# Altium project shelfControl.PrjPCB
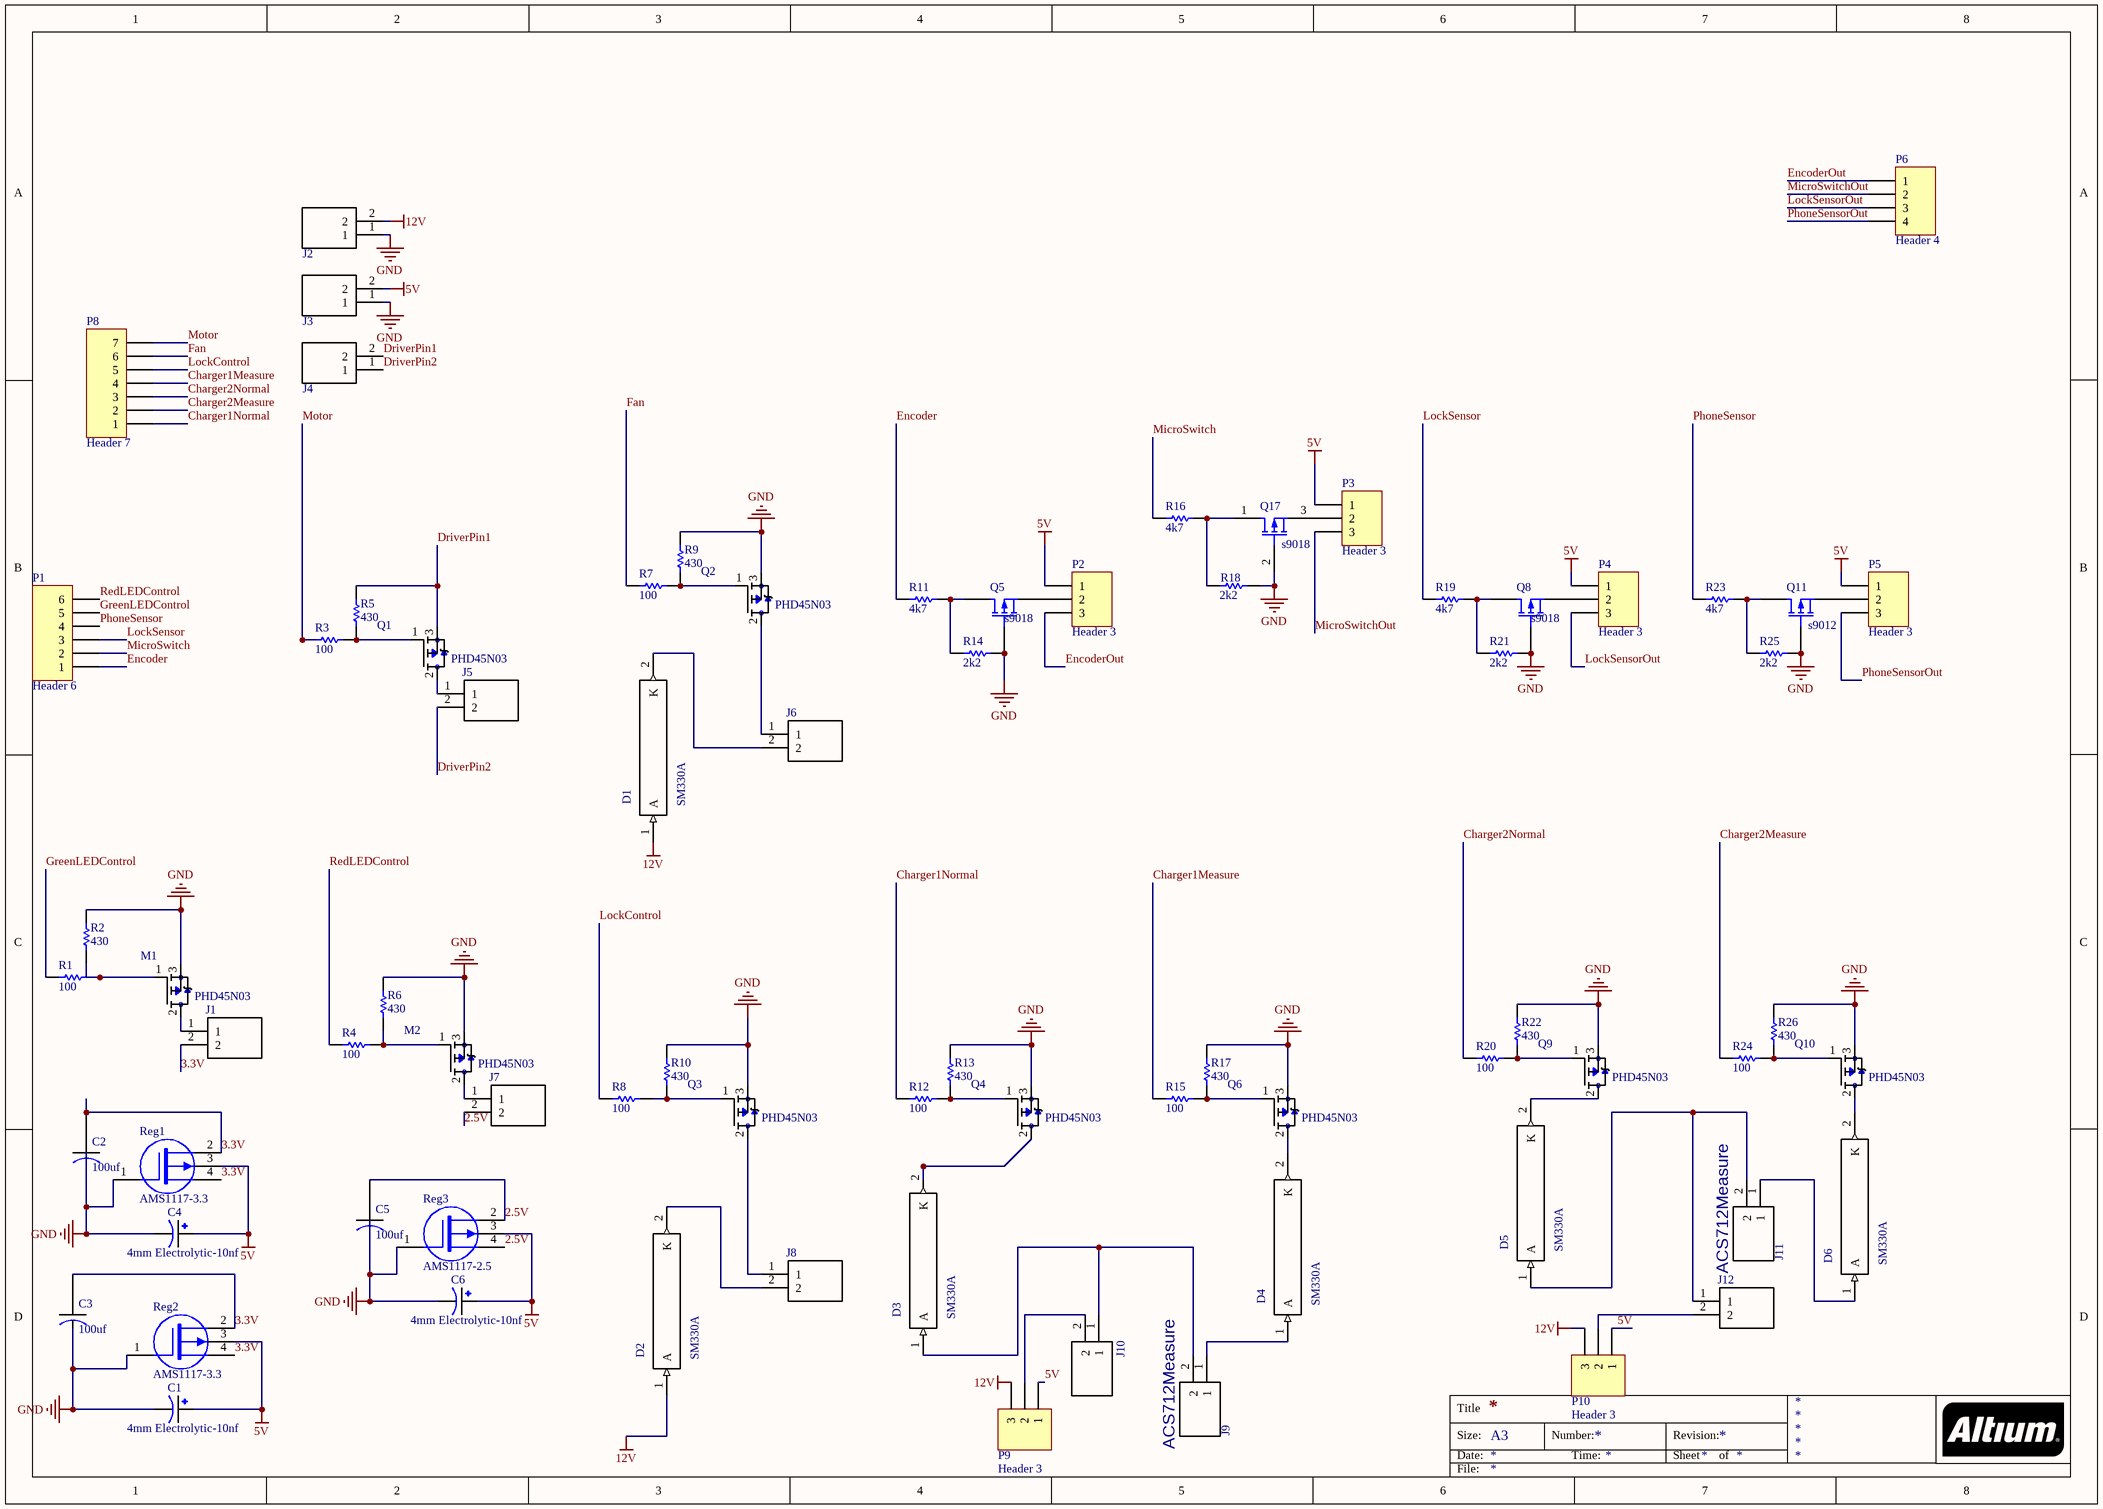
[diagram p0: shelfControl.SchDoc]
1 sheet, 75 parts. Net scope: global (net labels, ports and power ports of the same name join across sheets).
Board files: shelfControl 5V.PcbDoc, shelfControl.PcbDoc, acs712Connect.PcbDoc, order-SecUpdate.PcbDoc

## Sheet shelfControl.SchDoc
size A3

### Parts
C1  4mm Electrolytic-10nf  [*CAP_EEE-FP1C100AR]
C2  100uf  [*CAPAE0607X600N_16SVPC100M(Primary)]
C3  100uf  [*CAPAE0607X600N_16SVPC100M(Primary)]
C4  4mm Electrolytic-10nf  [*CAP_EEE-FP1C100AR]
C5  100uf  [*CAPAE0607X600N_16SVPC100M(Primary)]
C6  4mm Electrolytic-10nf  [*CAP_EEE-FP1C100AR]
D1  SM330A  [*DIOM5227X270N_S1M(Primary)]
D2  SM330A  [*DIOM5227X270N_S1M(Primary)]
D3  SM330A  [*DIOM5227X270N_S1M(Primary)]
D4  SM330A  [*DIOM5227X270N_S1M(Primary)]
D5  SM330A  [*DIOM5227X270N_S1M(Primary)]
D6  SM330A  [*DIOM5227X270N_S1M(Primary)]
J1  6-1123723-2  [*TE_6-1123723-2]  (value not drawn)
J2  6-1123723-2  [*TE_6-1123723-2]  (value not drawn)
J3  6-1123723-2  [*TE_6-1123723-2]  (value not drawn)
J4  6-1123723-2  [*TE_6-1123723-2]  (value not drawn)
J5  6-1123723-2  [*TE_6-1123723-2]  (value not drawn)
J6  6-1123723-2  [*TE_6-1123723-2]  (value not drawn)
J7  6-1123723-2  [*TE_6-1123723-2]  (value not drawn)
J8  6-1123723-2  [*TE_6-1123723-2]  (value not drawn)
J9  ACS712Measure  [*TE_6-1123723-2]
J10  6-1123723-2  [*TE_6-1123723-2]  (value not drawn)
J11  ACS712Measure  [*TE_6-1123723-2]
J12  6-1123723-2  [*TE_6-1123723-2]  (value not drawn)
M1  PHD45N03  [*DPAK228P998X235-3N]
M2  PHD45N03  [*DPAK228P998X235-3N]
P1  Header 6  [HDR1X6]
P2  Header 3  [HDR1X3]
P3  Header 3  [HDR1X3]
P4  Header 3  [HDR1X3]
P5  Header 3  [HDR1X3]
P6  Header 4  [HDR1X4]
P8  Header 7  [HDR1X7]
P9  Header 3  [HDR1X3]
P10  Header 3  [HDR1X3]
Q1  PHD45N03  [*DPAK228P998X235-3N]
Q2  PHD45N03  [*DPAK228P998X235-3N]
Q3  PHD45N03  [*DPAK228P998X235-3N]
Q4  PHD45N03  [*DPAK228P998X235-3N]
Q5  s9018  [SOT-23_N]
Q6  PHD45N03  [*DPAK228P998X235-3N]
Q8  s9018  [SOT-23_N]
Q9  PHD45N03  [*DPAK228P998X235-3N]
Q10  PHD45N03  [*DPAK228P998X235-3N]
Q11  s9012  [SOT-23_N]
Q17  s9018  [SOT-23_N]
R1  value 100  [6-0805_L]  (hidden comment: R100)
R2  value 430  [6-0805_L]  (hidden comment: R430)
R3  value 100  [6-0805_L]  (hidden comment: R100)
R4  value 100  [6-0805_L]  (hidden comment: R100)
R5  value 430  [6-0805_L]  (hidden comment: R430)
R6  value 430  [6-0805_L]  (hidden comment: R430)
R7  value 100  [6-0805_L]  (hidden comment: R100)
R8  value 100  [6-0805_L]  (hidden comment: R100)
R9  value 430  [6-0805_L]  (hidden comment: R430)
R10  value 430  [6-0805_L]  (hidden comment: R430)
R11  value 4k7  [6-0805_L]  (hidden comment: R4k7)
R12  value 100  [6-0805_L]  (hidden comment: R100)
R13  value 430  [6-0805_L]  (hidden comment: R430)
R14  value 2k2  [6-0805_L]  (hidden comment: R2k2)
R15  value 100  [6-0805_L]  (hidden comment: R100)
R16  value 4k7  [6-0805_L]  (hidden comment: R4k7)
R17  value 430  [6-0805_L]  (hidden comment: R430)
R18  value 2k2  [6-0805_L]  (hidden comment: R2k2)
R19  value 4k7  [6-0805_L]  (hidden comment: R4k7)
R20  value 100  [6-0805_L]  (hidden comment: R100)
R21  value 2k2  [6-0805_L]  (hidden comment: R2k2)
R22  value 430  [6-0805_L]  (hidden comment: R430)
R23  value 4k7  [6-0805_L]  (hidden comment: R4k7)
R24  value 100  [6-0805_L]  (hidden comment: R100)
R25  value 2k2  [6-0805_L]  (hidden comment: R2k2)
R26  value 430  [6-0805_L]  (hidden comment: R430)
Reg1  AMS1117-3.3  [SOT223_N]
Reg2  AMS1117-3.3  [SOT223_N]
Reg3  AMS1117-2.5  [SOT223_N]

### Nets
5V: C1.1 C4.1 C6.1 J3.2 P2.1 P3.1 P4.1 P5.1 P9.1 P10.1 Reg1.3(U) Reg2.3(U) Reg3.3(U)
12V: D1.1(A) D2.1(A) J2.2 P9.3 P10.3
GND: C1.2 C2.NEG C3.NEG C4.2 C5.NEG C6.2 J2.1 J3.1 M1.3(S) M2.3(S) Q2.3(S) Q3.3(S) Q4.3(S) Q5.2(G) Q6.3(S) Q8.2(G) Q9.3(S) Q10.3(S) Q11.2(G) Q17.2(G) R2.1 R6.1 R9.1 R10.1 R13.1 R14.2 R17.1 R18.1 R21.2 R22.1 R25.2 R26.1 Reg1.1(G) Reg2.1(G) Reg3.1(G)
2.5V: C5.POS J7.2 Reg3.2(D) Reg3.4(S)
3.3V: C2.POS C3.POS J1.2 Reg1.2(D) Reg1.4(S) Reg2.2(D) Reg2.4(S)
Charger1Measure: P8.4 R15.1
Charger1Normal: P8.1 R12.1
Charger2Measure: P8.2 R24.1
Charger2Normal: P8.3 R20.1
DriverPin1: J4.2 Q1.3(S) R5.1
DriverPin2: J4.1 J5.2
Encoder: P1.1 R11.1
EncoderOut: P2.3 P6.1
Fan: P8.6 R7.1
GreenLEDControl: P1.5 R1.1
LockControl: P8.5 R8.1
LockSensor: P1.3 R19.1
LockSensorOut: P4.3 P6.3
MicroSwitch: P1.2 R16.2
MicroSwitchOut: P3.3 P6.2
Motor: P8.7 R3.1
PhoneSensor: P1.4 R23.1
PhoneSensorOut: P5.3 P6.4
RedLEDControl: P1.6 R4.1
NetD1_2: D1.2(K) J6.2
NetD2_2: D2.2(K) J8.2
NetD3_1: D3.1(A) J9.2 J10.1
NetD3_2: D3.2(K) Q4.2(D)
NetD4_1: D4.1(A) J9.1
NetD4_2: D4.2(K) Q6.2(D)
NetD5_1: D5.1(A) J11.2 J12.1
NetD5_2: D5.2(K) Q9.2(D)
NetD6_1: D6.1(A) J11.1
NetD6_2: D6.2(K) Q10.2(D)
NetJ1_1: J1.1 M1.2(D)
NetJ5_1: J5.1 Q1.2(D)
NetJ6_1: J6.1 Q2.2(D)
NetJ7_1: J7.1 M2.2(D)
NetJ8_1: J8.1 Q3.2(D)
NetJ10_2: J10.2 P9.2
NetJ12_2: J12.2 P10.2
NetM1_1: M1.1(G) R1.2 R2.2
NetM2_1: M2.1(G) R4.2 R6.2
NetP2_2: P2.2 Q5.3(S)
NetP3_2: P3.2 Q17.3(S)
NetP4_2: P4.2 Q8.3(S)
NetP5_2: P5.2 Q11.3(S)
NetQ1_1: Q1.1(G) R3.2 R5.2
NetQ2_1: Q2.1(G) R7.2 R9.2
NetQ3_1: Q3.1(G) R8.2 R10.2
NetQ4_1: Q4.1(G) R12.2 R13.2
NetQ5_1: Q5.1(D) R11.2 R14.1
NetQ6_1: Q6.1(G) R15.2 R17.2
NetQ8_1: Q8.1(D) R19.2 R21.1
NetQ9_1: Q9.1(G) R20.2 R22.2
NetQ10_1: Q10.1(G) R24.2 R26.2
NetQ11_1: Q11.1(D) R23.2 R25.1
NetQ17_1: Q17.1(D) R16.1 R18.2

### Notes on the sheet
- Title
- Size:
- Date:
- A3
- Number:
- Time:
- Revision:
- Sheet
- of
- File:

### Library data of the parts
C1 C4 C6 = EEE-FP1C100AR: Electrolytic capacitor SMD 10 آµF 16 V 20 % _أک x L_ 4 mm x 5.8 mm Panasonic EEEFP1C100AR 1 pc_s_; MF: Panasonic Electronic; MP: EEEFP1C100AR; Price: None; Availability: Unavailable; Package: Radial Panasonic; SnapEDA_Link: https://www.snapeda.com/parts/EEEFP1C100AR/Panasonic%20Electronic%20Components/view-part/?ref=snap; Value: *
C2 C3 C5 = 16SVPC100M: SVPC Series 16 V 100 uF أک 6.3 x 5.9 mm Surface Mount Polymer Aluminum Capacitor; MF: Panasonic; MP: 16SVPC100M; Price: None; Availability: Unavailable; Package: Radial Panasonic; SnapEDA_Link: https://www.snapeda.com/parts/16SVPC100M/Panasonic%20Electronic%20Components/view-part/?ref=snap; Value: *
D1-D6 = STPS2L60A: SCHOTTKY RECTIFIER 2A; Voltage Vrrm: 60V; Diode Case Style: DO-214AC; Case Style: DO-214AC; pin to pad: 1>A 2>A; MF: STMicroelectronics; Price: None; Availability: Unavailable; SnapEDA_Link: https://www.snapeda.com/parts/STPS2L60A/STMicroelectronics/view-part/?ref=snap; Package: DO-214 STMicroelectronics; MP: STPS2L60A; Value: *
J1-J12 = 6-1123723-2: 3.96 EP HDR ASSY 2P_GREEN_; MF: TE Connectivity; Number_of_Positions: 2; Product_Type: Header; Centerline_Pitch: 3.96 mm[.156 in]; TE_purchase_URL: https://www.te.com/usa-en/product-6-1123723-2.html?te_bu=Cor&te_type=disp&te_campaign=seda_glo_cor-seda-global-disp-prtnr-fy19-seda-model-bom-cta_sma-317_1&elqCampaignId=32493; MP: 6-1123723-2; Price: None; Availability: Unavailable; Package: None; EU_RoHS_Compliance: Compliant; SnapEDA_Link: https://www.snapeda.com/parts/6-1123723-2/TE%20Connectivity%20AMP%20Connectors/view-part/?ref=snap; Value: *
M1 M2 Q1-Q4 Q6 Q9 Q10 = IPD50P04P4L-11: P-Channel 40 V 10.6 mOhm OptiMOSآ®-P2 Power-Transistor -PG-TO-252-3; MF: Infineon Technologies; MP: IPD50P04P4L-11; Package: TO-252-3 Infineon; Price: None; Availability: Unavailable; SnapEDA_Link: https://www.snapeda.com/parts/IPD50P04P4L-11/Infineon%20Technologies/view-part/?ref=snap; Value: *
P1 = Header 6: Header, 6-Pin; LatestRevisionDate: 17-Jul-2002; LatestRevisionNote: Re-released for DXP Platform.; Publisher: Altium Limited
P2-P5 P9 P10 = Header 3: Header, 3-Pin; LatestRevisionDate: 17-Jul-2002; LatestRevisionNote: Re-released for DXP Platform.; Publisher: Altium Limited
P6 = Header 4: Header, 4-Pin; LatestRevisionDate: 17-Jul-2002; LatestRevisionNote: Re-released for DXP Platform.; Publisher: Altium Limited
P8 = Header 7: Header, 7-Pin; LatestRevisionDate: 17-Jul-2002; LatestRevisionNote: Re-released for DXP Platform.; Publisher: Altium Limited
Q5 Q8 Q11 Q17 = MOSFET-P: P-Channel MOSFET; Published: 8-Jun-2000; LatestRevisionDate: 17-Jul-2002; LatestRevisionNote: Re-released for DXP Platform.; PackageVersion: 1995/1996; PackageReference: E3; Publisher: Altium Limited; PackageDescription: TO, Flat Index; 3 In-Line, Axial Leads; Body Dia. 4.6mm; Lead Dia. 0.5 mm (max)
R1-R26 = Res1: Resistor; Published: 8-Jun-2000; LatestRevisionDate: 17-Jul-2002; LatestRevisionNote: Re-released for DXP Platform.; PackageReference: AXIAL-0.3; Publisher: Altium Limited; PackageDescription: Axial Device, Thru-Hole; 2 Leads; 0.3 in Pin Spacing
Reg1-Reg3 = MOSFET-P4: P-Channel MOSFET, Externally Terminated Substrate; Published: 24-Mar-1999; LatestRevisionDate: 29-May-2009; LatestRevisionNote: IPC-7351 Footprint Added.; PackageVersion: 2002; PackageReference: SOT223; Publisher: Altium Limited; PackageDescription: 4-Pin SOT-223 Package 2.3 mm Pitch, 7 mm Lead Span; Code_JEITA: SC-75; Code_JEDEC: TO-261-AA-B; Code_IPC: SOT223-4